# Altium schematic sheet Logic_Connectors.SchDoc
size A
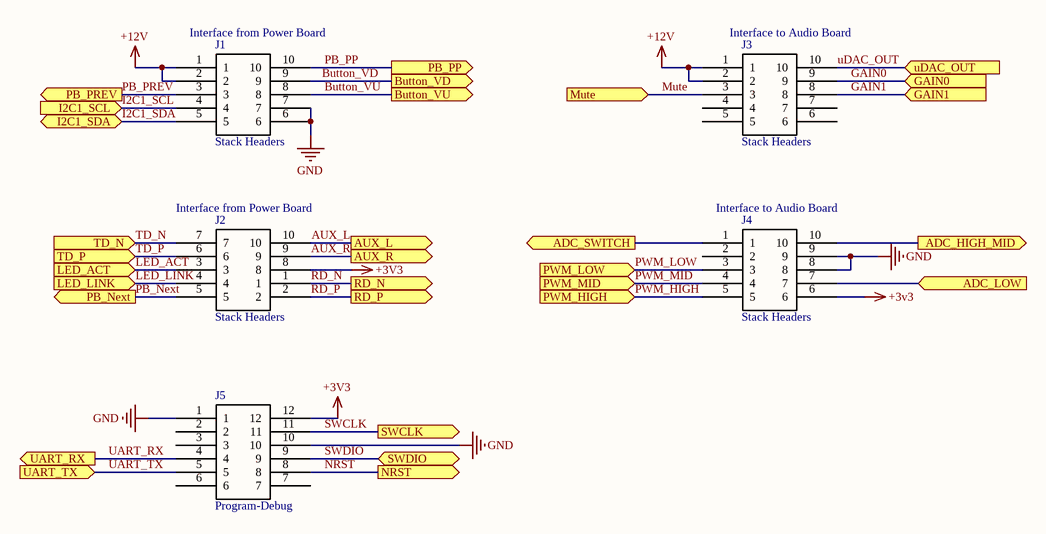
[diagram p0: Logic_Connectors.SchDoc]

## Parts
J1  Stack Headers  [SSW-105]
J2  Stack Headers  [SSW-105]
J3  Stack Headers  [TSW-105]
J4  Stack Headers  [TSW-105]
J5  Program-Debug  [SSW_Double_Header]

## Ports
ADC_HIGH_MID (out), ADC_LOW (in), ADC_SWITCH (out), AUX_L (out), AUX_R (out), Button_VD (out), Button_VU (out), GAIN0 (in), GAIN1 (in), I2C1_SCL (in), I2C1_SDA (bidir), LED_ACT (in), LED_LINK (in), Mute (in), NRST (out), PB_Next (out), PB_PP (out), PB_PREV (out), PWM_HIGH (in), PWM_LOW (in), PWM_MID (in), RD_N (out), RD_P (out), SWCLK (out), SWDIO (bidir), TD_N (in), TD_P (in), UART_RX (out), UART_TX (in), uDAC_OUT (in)

## Nets
+3V3: J2.8 J4.6 J5.12
+12V: J1.1 J1.2 J3.1 J3.2
GND: J1.6 J1.7 J4.8 J4.9 J5.1 J5.10
ADC_HIGH_MID: J4.10 ; port ADC_HIGH_MID
ADC_LOW: J4.7 ; port ADC_LOW
ADC_SWITCH: J4.1 ; port ADC_SWITCH
AUX_L: J2.10 ; port AUX_L
AUX_R: J2.9 ; port AUX_R
Button_VD: J1.9 ; port Button_VD
Button_VU: J1.8 ; port Button_VU
GAIN0: J3.9 ; port GAIN0
GAIN1: J3.8 ; port GAIN1
I2C1_SCL: J1.4 ; port I2C1_SCL
I2C1_SDA: J1.5 ; port I2C1_SDA
LED_ACT: J2.3 ; port LED_ACT
LED_LINK: J2.4 ; port LED_LINK
Mute: J3.3 ; port Mute
NRST: J5.8 ; port NRST
PB_Next: J2.5 ; port PB_Next
PB_PP: J1.10 ; port PB_PP
PB_PREV: J1.3 ; port PB_PREV
PWM_HIGH: J4.5 ; port PWM_HIGH
PWM_LOW: J4.3 ; port PWM_LOW
PWM_MID: J4.4 ; port PWM_MID
RD_N: J2.1 ; port RD_N
RD_P: J2.2 ; port RD_P
SWCLK: J5.11 ; port SWCLK
SWDIO: J5.9 ; port SWDIO
TD_N: J2.7 ; port TD_N
TD_P: J2.6 ; port TD_P
UART_RX: J5.4 ; port UART_RX
UART_TX: J5.5 ; port UART_TX
uDAC_OUT: J3.10 ; port uDAC_OUT

Not connected (* = marked no-connect by the designer): J3 4 5 6 7; J4 2; J5 2 3 6 7

## Notes on the sheet
- (near J1) Interface from Power Board
- (near J3) Interface to Audio Board
- (near J2) Interface from Power Board
- (near J4) Interface to Audio Board

## Library data of the parts
J1-J4 = Stack Headers: System: Connector